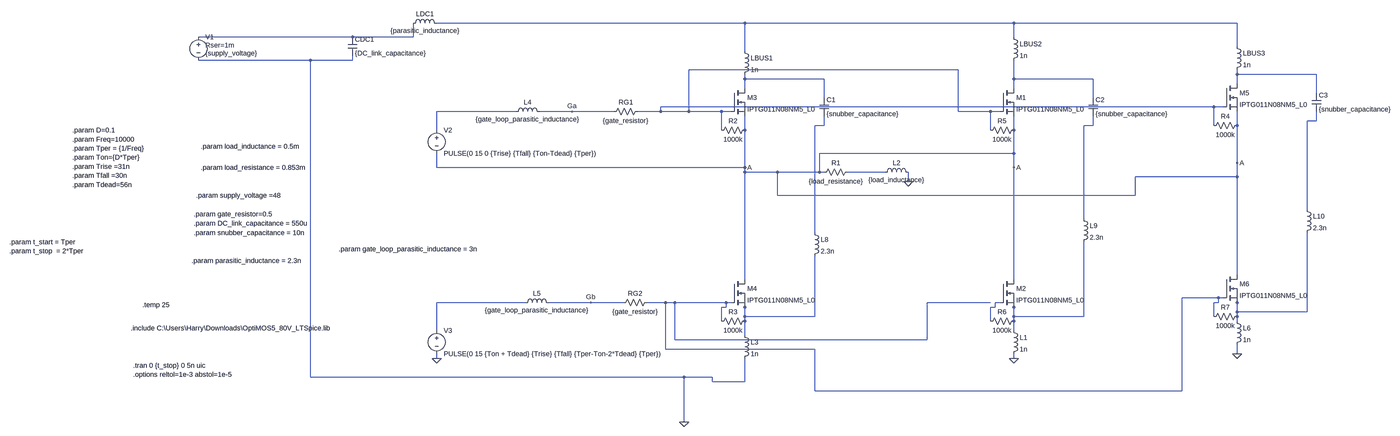
[diagram p0: schematic prior_to_gate_driver_implementation.asc, whole sheet]
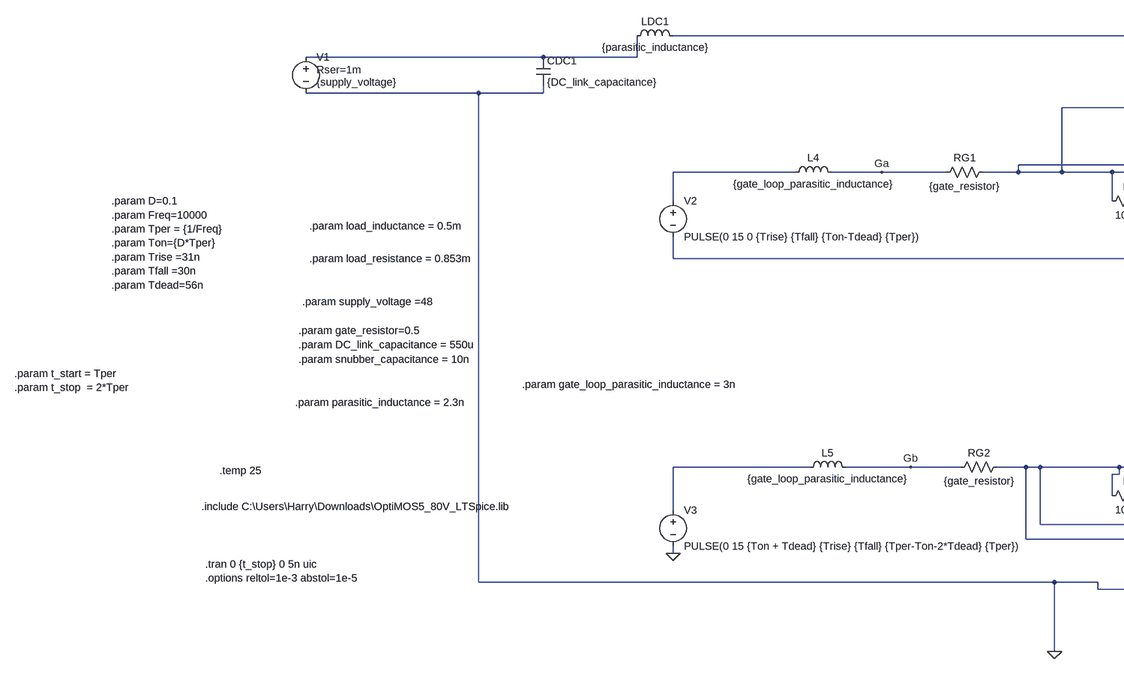
[diagram p1: schematic prior_to_gate_driver_implementation.asc, part, row 1 of 1, column 1 of 2]
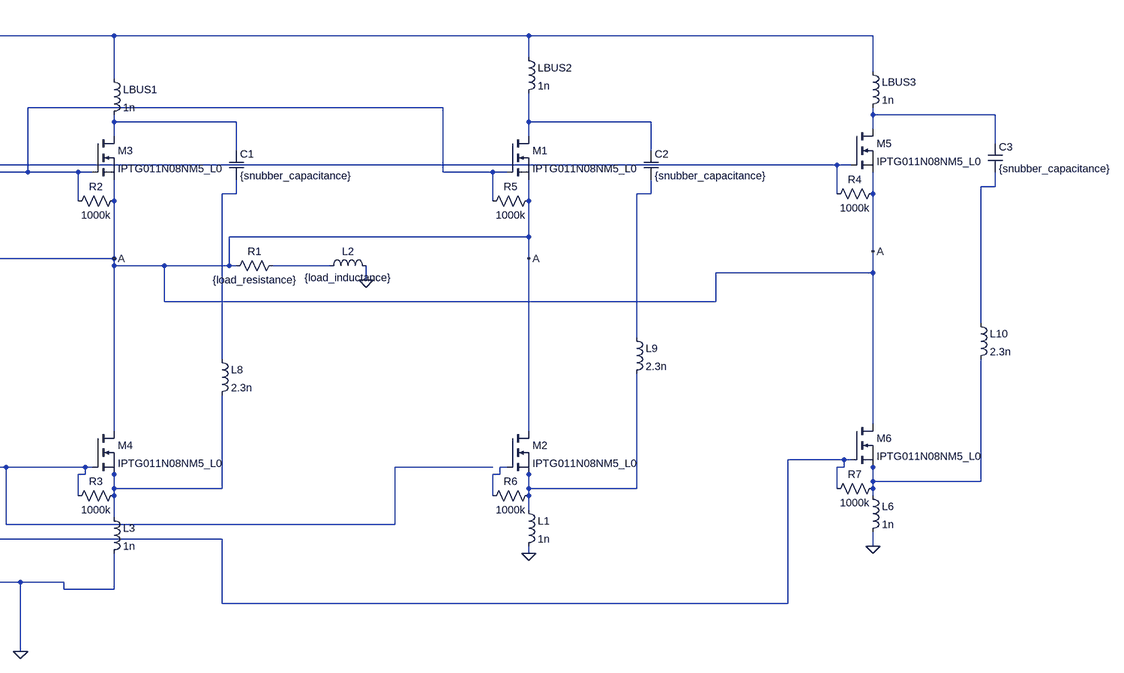
[diagram p2: schematic prior_to_gate_driver_implementation.asc, part, row 1 of 1, column 2 of 2]
prior_to_gate_driver_implementation.asc, the LTspice schematic file:
Version 4.1
SHEET 1 7924 1440
WIRE 1136 -560 80 -560
WIRE 2176 -560 1136 -560
WIRE 3136 -560 2176 -560
WIRE -208 -512 -736 -512
WIRE 0 -512 0 -560
WIRE 0 -512 -208 -512
WIRE 2176 -512 2176 -560
WIRE 3136 -480 3136 -560
WIRE 1136 -464 1136 -560
WIRE -352 -432 -736 -432
WIRE -208 -432 -208 -448
WIRE -208 -432 -352 -432
WIRE 1920 -400 944 -400
WIRE 3136 -384 3136 -400
WIRE 3408 -384 3136 -384
WIRE 1136 -368 1136 -384
WIRE 1408 -368 1136 -368
WIRE 2176 -368 2176 -432
WIRE 2448 -368 2176 -368
WIRE 3136 -352 3136 -384
WIRE 1136 -336 1136 -368
WIRE 2176 -336 2176 -368
WIRE 3408 -320 3408 -384
WIRE 1408 -304 1408 -368
WIRE 2448 -304 2448 -368
WIRE 3056 -272 848 -272
WIRE 3088 -272 3056 -272
WIRE 352 -256 80 -256
WIRE 544 -256 432 -256
WIRE 688 -256 544 -256
WIRE 848 -256 848 -272
WIRE 848 -256 768 -256
WIRE 944 -256 944 -400
WIRE 944 -256 848 -256
WIRE 1056 -256 944 -256
WIRE 1088 -256 1056 -256
WIRE 1920 -256 1920 -400
WIRE 2096 -256 1920 -256
WIRE 2128 -256 2096 -256
WIRE 3408 -224 3408 -256
WIRE 3408 -224 3376 -224
WIRE 1408 -208 1408 -240
WIRE 1408 -208 1376 -208
WIRE 2448 -208 2448 -240
WIRE 2448 -208 2416 -208
WIRE 3056 -208 3056 -272
WIRE 3136 -208 3136 -256
WIRE 80 -192 80 -256
WIRE 1056 -192 1056 -256
WIRE 1136 -192 1136 -240
WIRE 2096 -192 2096 -256
WIRE 2176 -192 2176 -240
WIRE 2176 -112 2176 -192
WIRE 2176 -112 1392 -112
WIRE 3136 -80 3136 -208
WIRE 80 -64 80 -112
WIRE 1136 -64 1136 -192
WIRE 1136 -64 80 -64
WIRE 2176 -64 2176 -112
WIRE 1136 -48 1136 -64
WIRE 1248 -48 1136 -48
WIRE 1392 -48 1392 -112
WIRE 1392 -48 1248 -48
WIRE 1408 -48 1392 -48
WIRE 1616 -48 1488 -48
WIRE 3136 -32 3136 -80
WIRE 3136 -32 2592 -32
WIRE 1696 -16 1696 -48
WIRE 1248 32 1248 -48
WIRE 2592 32 2592 -32
WIRE 2592 32 1248 32
WIRE 3376 80 3376 -224
WIRE 2416 112 2416 -208
WIRE 1376 160 1376 -208
WIRE 3136 304 3136 -32
WIRE 1136 320 1136 -48
WIRE 2176 320 2176 -64
WIRE 3072 384 2752 384
WIRE 3088 384 3072 384
WIRE 384 400 80 400
WIRE 608 400 464 400
WIRE 720 400 608 400
WIRE 864 400 800 400
WIRE 896 400 864 400
WIRE 1072 400 896 400
WIRE 1088 400 1072 400
WIRE 2096 400 1760 400
WIRE 2128 400 2112 400
WIRE 3072 400 3072 384
WIRE 3072 400 3056 400
WIRE 3136 400 3136 384
WIRE 1072 416 1072 400
WIRE 1072 416 1056 416
WIRE 1136 416 1136 400
WIRE 2112 416 2112 400
WIRE 2112 416 2096 416
WIRE 2176 416 2176 400
WIRE 3136 432 3136 400
WIRE 3376 432 3376 160
WIRE 3376 432 3136 432
WIRE 1136 448 1136 416
WIRE 1376 448 1376 240
WIRE 1376 448 1136 448
WIRE 2176 448 2176 416
WIRE 2416 448 2416 192
WIRE 2416 448 2176 448
WIRE 3056 448 3056 400
WIRE 3136 448 3136 432
WIRE 1056 464 1056 416
WIRE 1136 464 1136 448
WIRE 2096 464 2096 416
WIRE 2176 464 2176 448
WIRE 3136 464 3136 448
WIRE 80 496 80 400
WIRE 2176 496 2176 464
WIRE 1136 512 1136 464
WIRE 896 528 896 400
WIRE 1760 528 1760 400
WIRE 1760 528 896 528
WIRE 864 560 864 400
WIRE 1376 560 864 560
WIRE 3136 576 3136 544
WIRE 80 592 80 576
WIRE 2176 592 2176 576
WIRE -352 656 -352 -432
WIRE 928 656 -352 656
WIRE 1024 656 928 656
WIRE 1024 672 1024 656
WIRE 1136 672 1136 592
WIRE 1136 672 1024 672
WIRE 1376 704 1376 560
WIRE 2752 704 2752 384
WIRE 2752 704 1376 704
WIRE 928 832 928 656
FLAG 544 -256 Ga
FLAG 608 400 Gb
FLAG 1696 -16 0
FLAG 1136 -64 A
FLAG 80 592 0
FLAG 928 832 0
FLAG 2176 -64 A
FLAG 2176 592 0
FLAG 3136 -80 A
FLAG 3136 576 0
SYMBOL voltage -736 -528 R0
WINDOW 123 0 0 Left 0
WINDOW 39 24 44 Left 2
WINDOW 3 24 72 Left 2
SYMATTR SpiceLine Rser=1m
SYMATTR Value {supply_voltage}
SYMATTR InstName V1
SYMBOL cap -224 -512 R0
SYMATTR InstName CDC1
SYMATTR Value {DC_link_capacitance}
SYMATTR SpiceLine Rser=1m
SYMBOL ind -16 -544 R270
WINDOW 0 32 56 VTop 2
WINDOW 3 5 56 VBottom 2
SYMATTR InstName LDC1
SYMATTR Value {parasitic_inductance}
SYMATTR SpiceLine Rser=1m
SYMBOL res 1504 -64 R90
WINDOW 0 0 56 VBottom 2
WINDOW 3 32 56 VTop 2
SYMATTR InstName R1
SYMATTR Value {load_resistance}
SYMBOL res 784 -272 R90
WINDOW 0 0 56 VBottom 2
WINDOW 3 32 56 VTop 2
SYMATTR InstName RG1
SYMATTR Value {gate_resistor}
SYMBOL res 816 384 R90
WINDOW 0 0 56 VBottom 2
WINDOW 3 32 56 VTop 2
SYMATTR InstName RG2
SYMATTR Value {gate_resistor}
SYMBOL ind 1120 -480 R0
SYMATTR InstName LBUS1
SYMATTR Value 1n
SYMATTR SpiceLine Rser=1m
SYMBOL ind 1600 -32 R270
WINDOW 0 32 56 VTop 2
WINDOW 3 5 56 VBottom 2
SYMATTR InstName L2
SYMATTR Value {load_inductance}
SYMATTR SpiceLine Rser=1m
SYMBOL ind 1120 496 R0
SYMATTR InstName L3
SYMATTR Value 1n
SYMATTR SpiceLine Rser=1m
SYMBOL voltage 80 -208 R0
WINDOW 123 0 0 Left 0
WINDOW 39 0 0 Left 0
SYMATTR InstName V2
SYMATTR Value PULSE(0 15 0 {Trise} {Tfall} {Ton-Tdead} {Tper})
SYMBOL voltage 80 480 R0
WINDOW 123 0 0 Left 0
WINDOW 39 0 0 Left 0
SYMATTR InstName V3
SYMATTR Value PULSE(0 15 {Ton + Tdead} {Trise} {Tfall} {Tper-Ton-2*Tdead} {Tper})
SYMBOL ind 336 -240 R270
WINDOW 0 32 56 VTop 2
WINDOW 3 5 56 VBottom 2
SYMATTR InstName L4
SYMATTR Value {gate_loop_parasitic_inductance}
SYMATTR SpiceLine Rser=1m
SYMBOL ind 368 416 R270
WINDOW 0 32 56 VTop 2
WINDOW 3 5 56 VBottom 2
SYMATTR InstName L5
SYMATTR Value {gate_loop_parasitic_inductance}
SYMATTR SpiceLine Rser=1m
SYMBOL res 1152 -208 R90
WINDOW 0 0 56 VBottom 2
WINDOW 3 32 56 VTop 2
SYMATTR InstName R2
SYMATTR Value 1000k
SYMBOL res 1152 448 R90
WINDOW 0 0 56 VBottom 2
WINDOW 3 32 56 VTop 2
SYMATTR InstName R3
SYMATTR Value 1000k
SYMBOL cap 1392 -304 R0
SYMATTR InstName C1
SYMATTR Value {snubber_capacitance}
SYMBOL nmos 1088 -336 R0
SYMATTR InstName M3
SYMATTR Value IPTG011N08NM5_L0
SYMATTR Prefix X
SYMBOL nmos 1088 320 R0
SYMATTR InstName M4
SYMATTR Value IPTG011N08NM5_L0
SYMATTR Prefix X
SYMBOL res 2192 -208 R90
WINDOW 0 0 56 VBottom 2
WINDOW 3 32 56 VTop 2
SYMATTR InstName R5
SYMATTR Value 1000k
SYMBOL res 2192 448 R90
WINDOW 0 0 56 VBottom 2
WINDOW 3 32 56 VTop 2
SYMATTR InstName R6
SYMATTR Value 1000k
SYMBOL cap 2432 -304 R0
SYMATTR InstName C2
SYMATTR Value {snubber_capacitance}
SYMBOL nmos 2128 -336 R0
SYMATTR InstName M1
SYMATTR Value IPTG011N08NM5_L0
SYMATTR Prefix X
SYMBOL nmos 2128 320 R0
SYMATTR InstName M2
SYMATTR Value IPTG011N08NM5_L0
SYMATTR Prefix X
SYMBOL res 3152 -224 R90
WINDOW 0 0 56 VBottom 2
WINDOW 3 32 56 VTop 2
SYMATTR InstName R4
SYMATTR Value 1000k
SYMBOL res 3152 432 R90
WINDOW 0 0 56 VBottom 2
WINDOW 3 32 56 VTop 2
SYMATTR InstName R7
SYMATTR Value 1000k
SYMBOL cap 3392 -320 R0
SYMATTR InstName C3
SYMATTR Value {snubber_capacitance}
SYMBOL nmos 3088 -352 R0
SYMATTR InstName M5
SYMATTR Value IPTG011N08NM5_L0
SYMATTR Prefix X
SYMBOL nmos 3088 304 R0
SYMATTR InstName M6
SYMATTR Value IPTG011N08NM5_L0
SYMATTR Prefix X
SYMBOL ind 2160 -528 R0
SYMATTR InstName LBUS2
SYMATTR Value 1n
SYMATTR SpiceLine Rser=1m
SYMBOL ind 3120 -496 R0
SYMATTR InstName LBUS3
SYMATTR Value 1n
SYMATTR SpiceLine Rser=1m
SYMBOL ind 1360 144 R0
SYMATTR InstName L8
SYMATTR Value 2.3n
SYMATTR SpiceLine Rser=1m
SYMBOL ind 2400 96 R0
SYMATTR InstName L9
SYMATTR Value 2.3n
SYMATTR SpiceLine Rser=1m
SYMBOL ind 3360 64 R0
SYMATTR InstName L10
SYMATTR Value 2.3n
SYMATTR SpiceLine Rser=1m
SYMBOL ind 2160 480 R0
SYMATTR InstName L1
SYMATTR Value 1n
SYMATTR SpiceLine Rser=1m
SYMBOL ind 3120 448 R0
SYMATTR InstName L6
SYMATTR Value 1n
SYMATTR SpiceLine Rser=1m
TEXT -1168 -192 Left 2 !.param D=0.1\n.param Freq=10000\n.param Tper = {1/Freq}\n.param Ton={D*Tper}\n.param Trise =31n\n.param Tfall =30n\n.param Tdead=56n
TEXT -960 616 Left 2 !.tran 0 {t_stop} 0 5n uic\n.options reltol=1e-3 abstol=1e-5
TEXT -968 488 Left 2 !.include C:\\Users\\Harry\\Downloads\\OptiMOS5_80V_LTSpice.lib
TEXT -928 408 Left 2 !.temp 25
TEXT -752 160 Left 2 !.param snubber_capacitance = 10n
TEXT -752 128 Left 2 !.param DC_link_capacitance = 550u
TEXT -752 96 Left 2 !.param gate_resistor=0.5
TEXT -744 32 Left 2 !.param supply_voltage =48
TEXT -728 -64 Left 2 !.param load_resistance = 0.853m
TEXT -728 -136 Left 2 !.param load_inductance = 0.5m
TEXT -760 256 Left 2 !.param parasitic_inductance = 2.3n
TEXT -256 216 Left 2 !.param gate_loop_parasitic_inductance = 3n
TEXT -1384 192 Left 2 !.param t_start = Tper\n.param t_stop  = 2*Tper

The netlist it stands for:
* prior_to_gate_driver_implementation.asc
V1 N002 0 {supply_voltage} Rser=1m
CDC1 N002 0 {DC_link_capacitance} Rser=1m
LDC1 N002 N001 {parasitic_inductance} Rser=1m
R1 N011 A {load_resistance}
RG1 N003 Ga {gate_resistor}
RG2 N012 Gb {gate_resistor}
LBUS1 N001 N005 1n Rser=1m
L2 N011 0 {load_inductance} Rser=1m
L3 N016 0 1n Rser=1m
V2 N007 A PULSE(0 15 0 {Trise} {Tfall} {Ton-Tdead} {Tper})
V3 N013 0 PULSE(0 15 {Ton + Tdead} {Trise} {Tfall} {Tper-Ton-2*Tdead} {Tper})
L4 N007 Ga {gate_loop_parasitic_inductance} Rser=1m
L5 N013 Gb {gate_loop_parasitic_inductance} Rser=1m
R2 A N003 1000k
R3 N016 N012 1000k
C1 N005 N009 {snubber_capacitance}
X§M3 N005 N003 A IPTG011N08NM5_L0  ; pins D G S
X§M4 A N012 N016 IPTG011N08NM5_L0  ; pins D G S
R5 A N003 1000k
R6 N017 N014 1000k
C2 N006 N010 {snubber_capacitance}
X§M1 N006 N003 A IPTG011N08NM5_L0  ; pins D G S
X§M2 A N014 N017 IPTG011N08NM5_L0  ; pins D G S
R4 A N003 1000k
R7 N015 N012 1000k
C3 N004 N008 {snubber_capacitance}
X§M5 N004 N003 A IPTG011N08NM5_L0  ; pins D G S
X§M6 A N012 N015 IPTG011N08NM5_L0  ; pins D G S
LBUS2 N001 N006 1n Rser=1m
LBUS3 N001 N004 1n Rser=1m
L8 N009 N016 2.3n Rser=1m
L9 N010 N017 2.3n Rser=1m
L10 N008 N015 2.3n Rser=1m
L1 N017 0 1n Rser=1m
L6 N015 0 1n Rser=1m
.param D=0.1
.param Freq=10000
.param Tper = {1/Freq}
.param Ton={D*Tper}
.param Trise =31n
.param Tfall =30n
.param Tdead=56n
.tran 0 {t_stop} 0 5n uic
.options reltol=1e-3 abstol=1e-5
.include C:\Users\Harry\Downloads\OptiMOS5_80V_LTSpice.lib
.temp 25
.param snubber_capacitance = 10n
.param DC_link_capacitance = 550u
.param gate_resistor=0.5
.param supply_voltage =48
.param load_resistance = 0.853m
.param load_inductance = 0.5m
.param parasitic_inductance = 2.3n
.param gate_loop_parasitic_inductance = 3n
.param t_start = Tper
.param t_stop  = 2*Tper
.backanno
.end